# EAGLE design intel_realsense_d4xx_depth_cam_multi (EAGLE 9.2.2)
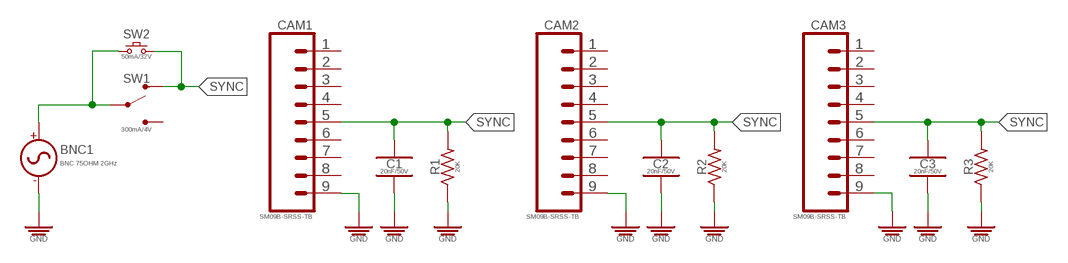
[diagram p0: schematic, sheet 1]

## Parts
BNC1  BNC 75OHM 2GHz  BNC_CONNECTOR_PTH_75OHM_2GHZ  [BNC_RA_1-1337543-0]
C1  20nF/50V  22NF_CER_SMD-0603_50V-10%  [CAPC1608X95]
C2  20nF/50V  22NF_CER_SMD-0603_50V-10%  [CAPC1608X95]
C3  20nF/50V  22NF_CER_SMD-0603_50V-10%  [CAPC1608X95]
CAM1  SM09B-SRSS-TB  1X09_SM09B-SRSS-TB  [SM09B-SRSS-TB]
CAM2  SM09B-SRSS-TB  1X09_SM09B-SRSS-TB  [SM09B-SRSS-TB]
CAM3  SM09B-SRSS-TB  1X09_SM09B-SRSS-TB  [SM09B-SRSS-TB]
R1  20K  20KΩ_SMD-0603_1/10W-5%  [RESC1608X65_SMD-0603]
R2  20K  20KΩ_SMD-0603_1/10W-5%  [RESC1608X65_SMD-0603]
R3  20K  20KΩ_SMD-0603_1/10W-5%  [RESC1608X65_SMD-0603]
SW1  300mA/4V  SWITCH_SPDT_RA_SMD_300MA-4V_6.7L-2.6W  [SW_SLIDE_SPDT_RA_SMD_4V_300MA_6.7L-2.6W]
SW2  50mA/32V  SWITCH_MOMENTARY_SPST-NO_SMD_50MA-32V_L4.6-W2.8  [BTN_MOMENTARY_SPDT-NO_L4.6-W2.8]

## Nets
GND: BNC1.- C1.2 C2.2 C3.2 CAM1.9 CAM2.9 CAM3.9 R1.1 R2.1 R3.1
N$1: BNC1.+ SW1.2(P) SW2.2
SYNC: C1.1 C2.1 C3.1 CAM1.5 CAM2.5 CAM3.5 R1.2 R2.2 R3.2 SW1.1(S1) SW2.3
Unconnected: CAM1.1 CAM1.2 CAM1.3 CAM1.4 CAM1.6 CAM1.7 CAM1.8 CAM2.1 CAM2.2 CAM2.3 CAM2.4 CAM2.6 CAM2.7 CAM2.8 CAM3.1 CAM3.2 CAM3.3 CAM3.4 CAM3.6 CAM3.7 CAM3.8 SW1.3(S2)

## Library data of the parts
BNC1 = PiB_connectors:BNC_CONNECTOR; DATASHEET: https://www.te.com/commerce/DocumentDelivery/DDEController?Action=srchrtrv&DocNm=1478032&DocType=Customer+Drawing&DocLang=English; DIST: Digikey; DISTLINK: https://www.digikey.com/products/en?keywords=A97560-ND; DISTPN: A97560-ND; MFR: TE Connectivity AMP Connectors; MPN: 1-1478032-0
C1-C3 = PiB_capacitors:22NF; DATASHEET: https://product.tdk.com/info/en/catalog/datasheets/mlcc_commercial_hightemp_en.pdf; DIST: Digikey; DISTLINK: https://www.digikey.com/products/en?keywords=445-2505-1-ND; DISTPN: 445-2505-1-ND; MFR: TDK Corporation; MPN: C1608X8R1H223K080AA
CAM1-CAM3 = PiB_connectors:1X09; DATASHEET: http://www.jst-mfg.com/product/pdf/eng/eSH.pdf; DATASHEET_HOUSING: http://www.jst-mfg.com/product/pdf/eng/eSH.pdf; DIST: Digikey; DISTLINK: https://www.digikey.com/products/en?keywords=455-1809-1-ND; DISTLINK_HOUSING: https://www.digikey.com/products/en?keywords=455-1399-ND; DISTPN: 455-1809-1-ND; DISTPN_HOUSING: 455-1399-ND; DIST_HOUSING: Digikey; MFR: JST Sales America Inc.; MFR_HOUSING: JST Sales America Inc.; MPN: SM09B-SRSS-TB(LF)(SN); MPN_HOUSING: SHR-09V-S
R1-R3 = PiB_resistors:20KΩ; DATASHEET: http://industrial.panasonic.com/www-cgi/jvcr13pz.cgi?E+PZ+3+AOA0001+ERJ3GEYJ203V+7+WW; DIST: Digikey; DISTLINK: https://www.digikey.com/products/en?keywords=P20KGCT-ND; DISTPN: P20KGCT-ND; MFR: Panasonic Electronic Components; MPN: ERJ-3GEYJ203V
SW1 = PiB_switches:SWITCH_SPDT; CREATOR: MrSwirlyEyes; DATASHEET: https://media.digikey.com/pdf/Data%20Sheets/APEM%20Components%20PDFs/MA_Series_.pdf; DIST: Digikey; DISTLINK: https://www.digikey.com/products/en?keywords=679-1847-1-ND; DISTPN: 679-1847-1-ND; MFR: APEM Inc.; MPN: MA12RTR; TESTED: YES
SW2 = PiB_switches:SWITCH_MOMENTARY; DATASHEET: https://www.ckswitches.com/media/1479/kmr2.pdf; DIST: Digikey; DISTLINK: https://www.digikey.com/products/en?keywords=401-1426-1-ND; DISTPN: 401-1426-1-ND; MFR: C&K; MPN: KMR211GLFS

## Board
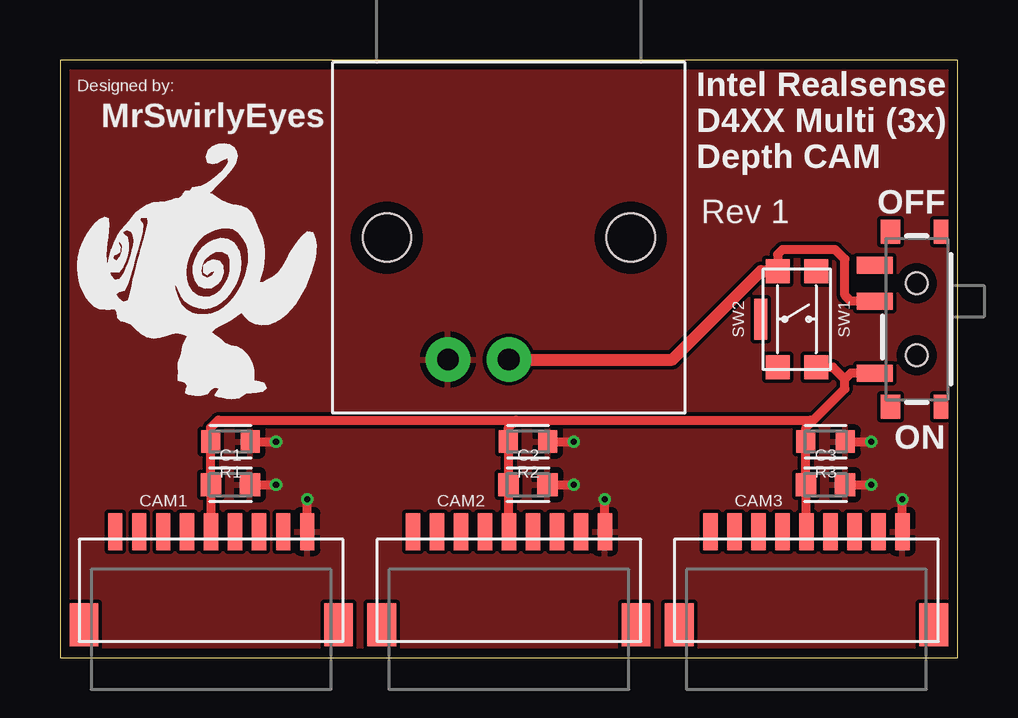
[diagram p1: board, top side]
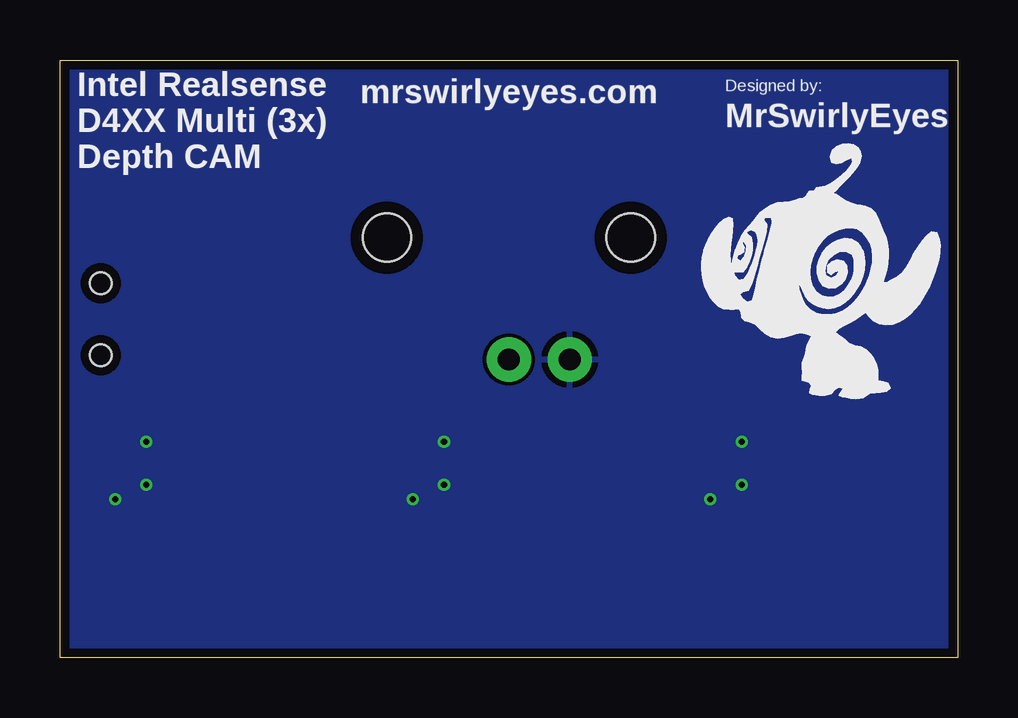
[diagram p2: board, bottom side, seen from below]

Size 37.4 x 24.9 mm. Coordinates in mm from the lower left corner, seen from the top.
Outline: 0,0 37.4,0 37.4,24.9 0,24.9 0,0
Copper layers (1*16): Top 0.035559375mm / dielectric 1.6mm / Bottom 0.035559375mm
Design rules "oshpark-2layer": minimum track width 6mil, minimum drill 10mil, track to track 6mil, track to pad 6mil, pad to pad 6mil, via to via 6mil, smd to smd 6mil, copper to edge 15mil, drill to drill 6mil, minimum pad ring 5mil, minimum via ring 5mil, stop-mask expansion 2.5mil, vias tented up to drill 0mil, thermal gap 10mil

### Footprints (pad centres in the part's own frame; a part is rotated, then mirrored left to right if it is on the bottom)
BNC_RA_1-1337543-0 = drill 0.9 pad 1.85: + 0,-5.08; - -2.54,-5.08 | hole 2.01: 5.08,0; -5.08,0
CAPC1608X95 = smd 0.846 x 0.97: 1 -0.812,0; 2 0.812,0
SM09B-SRSS-TB = smd 0.6 x 1.55: 1 -4,2.45; 2 -3,2.45; 3 -2,2.45; 4 -1,2.45; 5 0,2.45; 6 1,2.45; 7 2,2.45; 8 3,2.45; 9 4,2.45 | smd 1.2 x 1.8: TAB0 -5.3,-1.425; TAB1 5.3,-1.425
RESC1608X65_SMD-0603 = smd 0.788 x 0.929: 1 -0.82,0; 2 0.82,0
SW_SLIDE_SPDT_RA_SMD_4V_300MA_6.7L-2.6W = smd 1.5 x 0.7: 1 1.75,2.25; 2 1.75,-0.75; 3 1.75,-2.25 | smd 0.6 x 1: NC1 -1,-3.65; NC3 -1,3.65 | smd 0.8 x 1: NC2 1.1,-3.65; NC4 1.1,3.65 | hole 0.9: 0,-1.5; 0,1.5
BTN_MOMENTARY_SPDT-NO_L4.6-W2.8 = smd 1 x 1: 1 -2,0.8; 2 2,0.8; 3 -2,-0.8; 4 2,-0.8 | smd 1.7 x 0.55: P$1 0,1.5

### Placement (x,y rotation side)
BNC1  18.7,17.5 0 top
C1  7.1,7.2 0 top
C2  19.5,7.2 0 top
C3  31.9,7.2 0 top
CAM1  6.3,2.8 0 top
CAM2  18.7,2.8 0 top
CAM3  31.1,2.8 0 top
R1  7.1,9 180 top
R2  19.5,9 180 top
R3  31.9,9 180 top
SW1  35.7,14.1 180 top
SW2  30.7,14.1 90 top
U$4  [MRSWIRLYEYES-LOGO]  5.7,16.1 0 bottom
U$5  [MRSWIRLYEYES-LOGO]  5.7,16.1 0 top

### Tracks (layer width: path | path; a pad name or v marks a point on that pad's centre or on a via)
GND  (via drill 0.25)
  Top 0.381: C3.2 v33.8,7.2 | R3.1 v33.8,9 | C2.2 v21.4,7.2 | R2.1 v21.4,9 | C1.2 v9,7.2 | R1.1 v9,9 | CAM1.9 v10.3,6.6 | CAM2.9 v22.7,6.6 | CAM3.9 v35.1,6.6
  pour Bottom: 0,24.9 0,0 37.4,0 37.4,24.9
  pour Top: 0,24.9 0,0 37.4,0 37.4,24.9
N$1
  Top 0.381: SW1.2 32.95,14.85 32.7,15.1 32.7,16.6 32.3,17 30.1,17 29.9,16.8 SW2.2
  Top 0.508: BNC1.+ 25.52,12.42 29.2,16.1 SW2.2
SYNC
  Top 0.381: SW1.1 32.95,11.85 32.7,11.6 | 32.7,11.6 32.7,11.2 31.35,9.85 | SW2.3 32.2,12.1 32.7,11.6 | CAM1.5 6.3,7.19 C1.1 R1.2 6.28,9.58 6.6,9.9 19,9.9 | CAM3.5 31.09,5.26 C3.1 R3.2 31.08,9.58 31.35,9.85 | CAM2.5 18.69,5.26 C2.1 R2.2 18.68,9.58 19,9.9 | 31.35,9.85 31.3,9.9 19,9.9

### Text on the board
tPlace: Designed by: | Intel Realsense / D4XX Multi (3x) / Depth CAM | MrSwirlyEyes | Rev 1 | OFF | ON
bPlace: Designed by: | mrswirlyeyes.com | Intel Realsense / D4XX Multi (3x) / Depth CAM | MrSwirlyEyes